# Altium schematic sheet HV_Piezo_Driver.SchDoc
size 419 x 297 mm; SheetNumber: 3; SheetTotal: 4
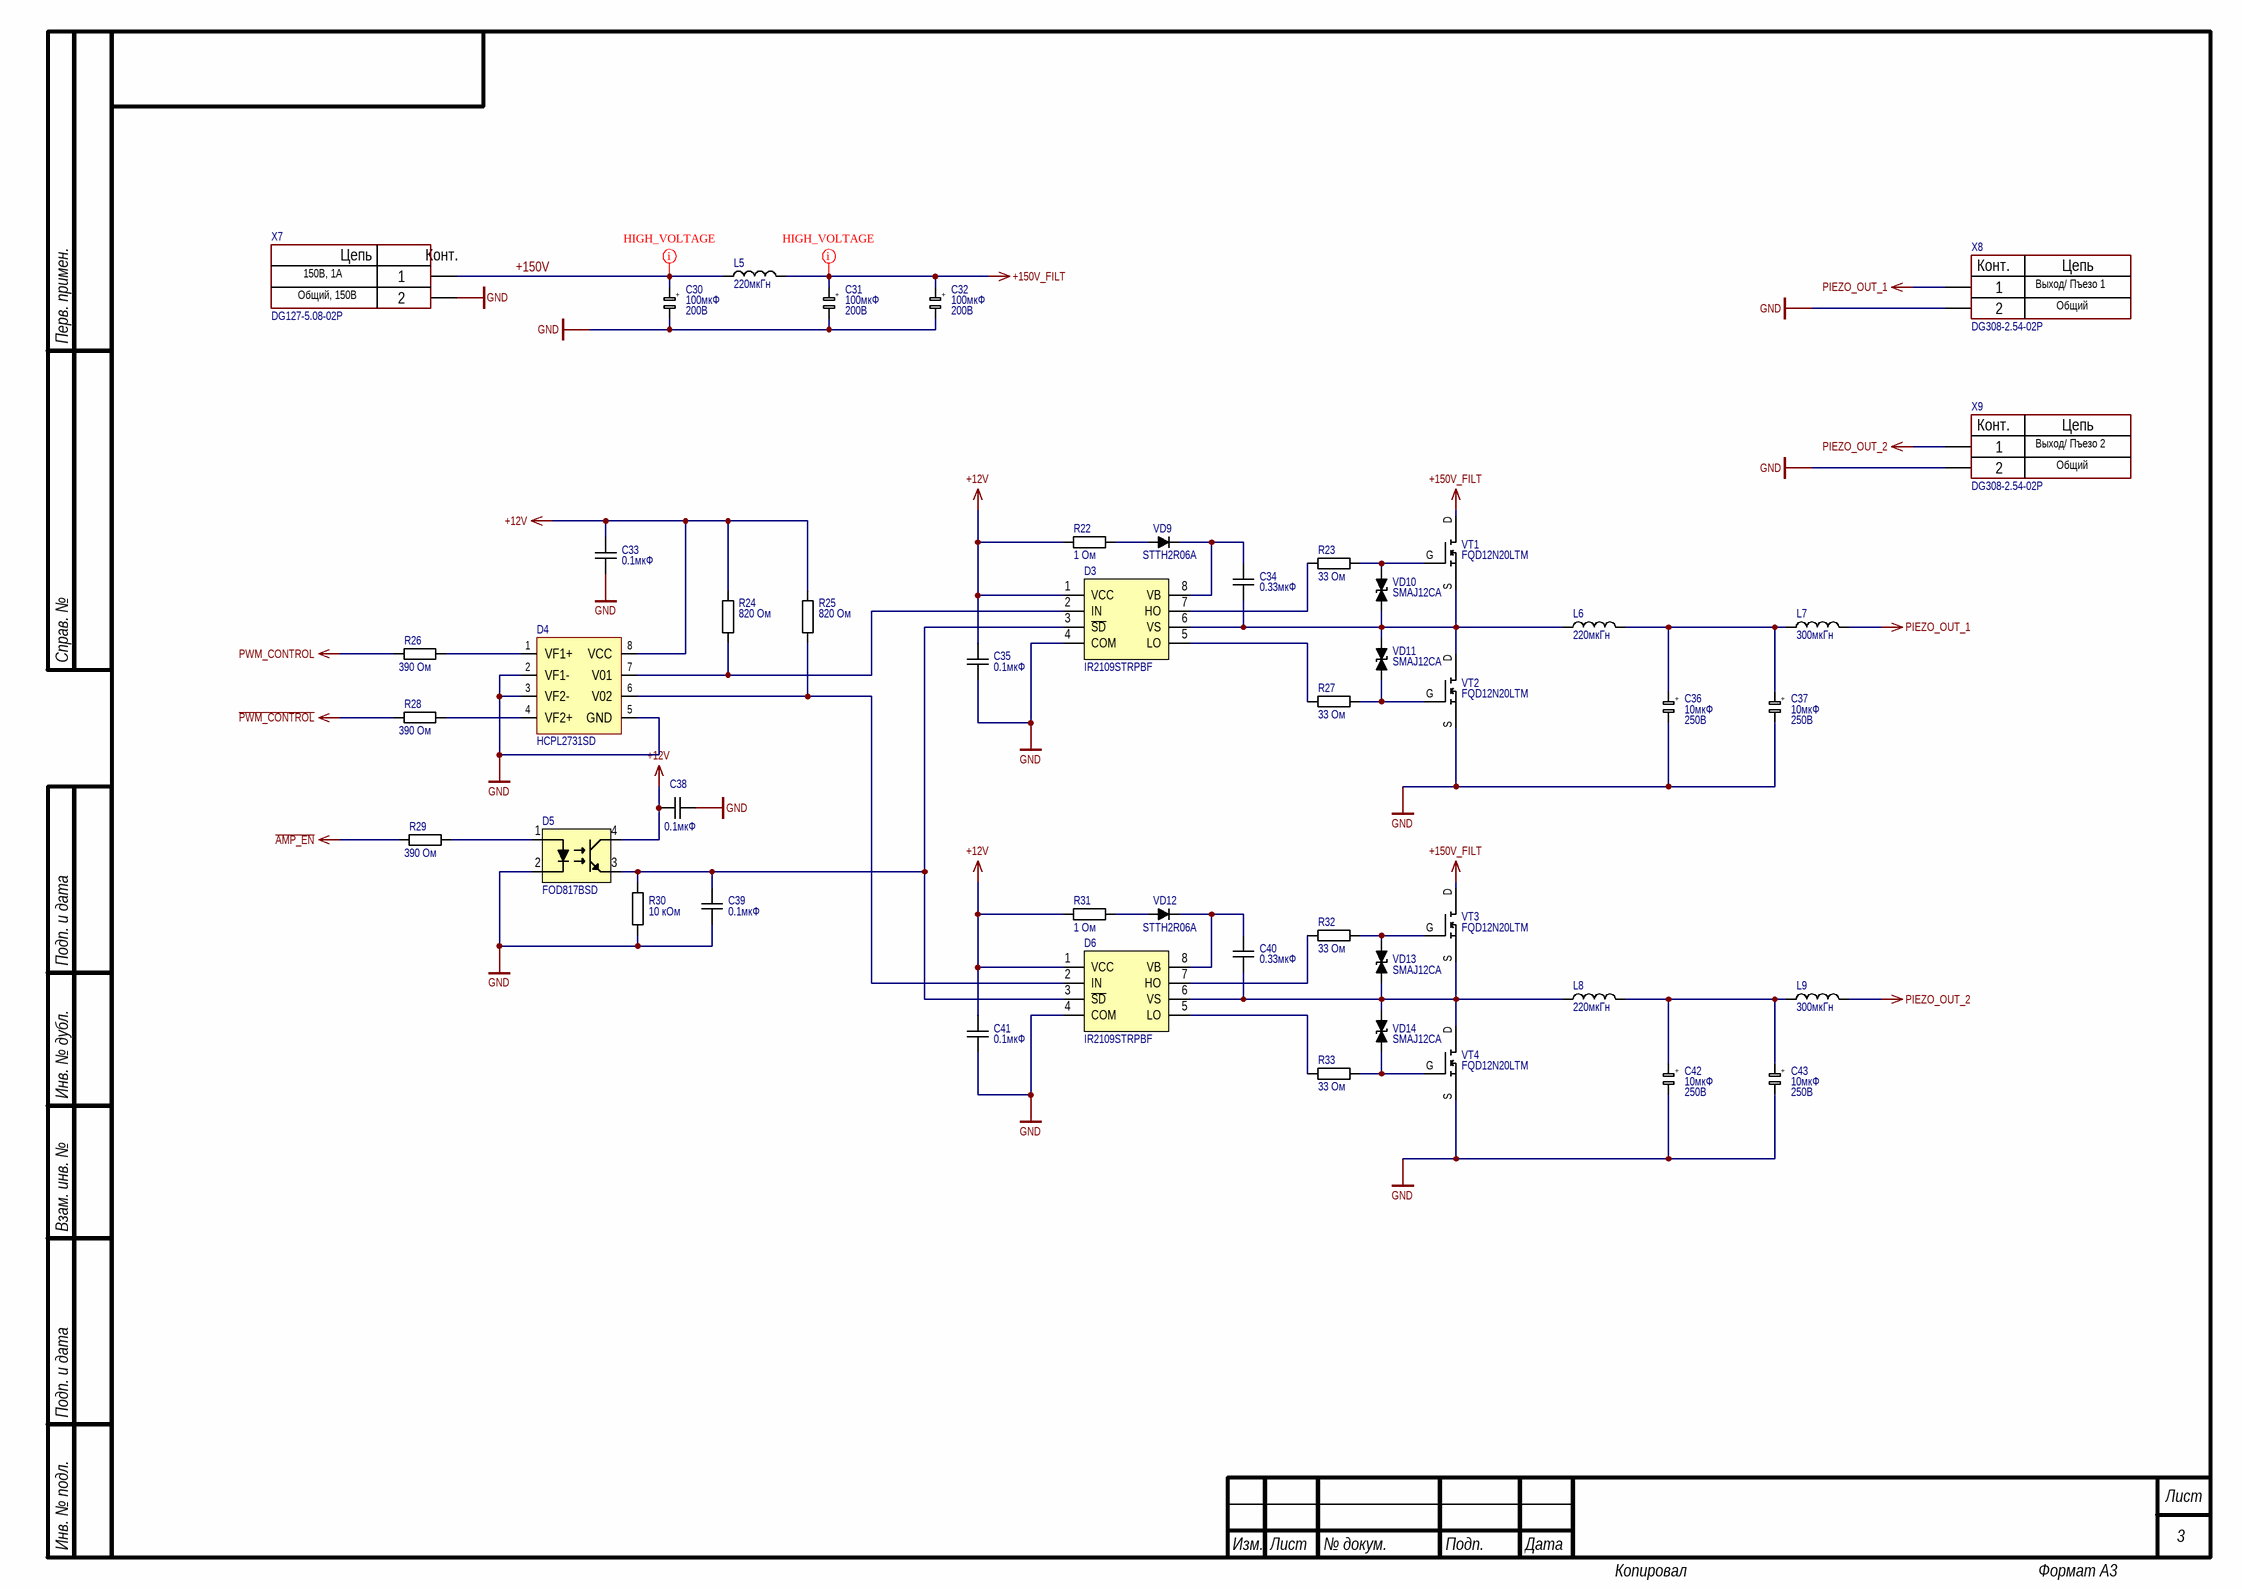
[diagram p0: HV_Piezo_Driver.SchDoc]

## Parts
C30  value 100мкФ  Voltage: 200В  [CAP_RADIAL_13x17_P5]  (hidden comment: CAP-100мкФ-20%-200В-105°C-Radial)
C31  value 100мкФ  Voltage: 200В  [CAP_RADIAL_13x17_P5]  (hidden comment: CAP-100мкФ-20%-200В-105°C-Radial)
C32  value 100мкФ  Voltage: 200В  [CAP_RADIAL_13x17_P5]  (hidden comment: CAP-100мкФ-20%-200В-105°C-Radial)
C33  value 0.1мкФ  [CAP-0603]  (hidden comment: CAP-0.1мкФ-10%-50В-X7R-0603)
C34  value 0.33мкФ  [CAP-0805]  (hidden comment: CAP-0.33мкФ-10%-25В-X7R-0805)
C35  value 0.1мкФ  [CAP-0603]  (hidden comment: CAP-0.1мкФ-10%-50В-X7R-0603)
C36  value 10мкФ  Voltage: 250В  [CAP_RADIAL_10x20_P5]  (hidden comment: CAP-10мкФ-20%-250В-105°C-Radial)
C37  value 10мкФ  Voltage: 250В  [CAP_RADIAL_10x20_P5]  (hidden comment: CAP-10мкФ-20%-250В-105°C-Radial)
C38  value 0.1мкФ  [CAP-0603]  (hidden comment: CAP-0.1мкФ-10%-50В-X7R-0603)
C39  value 0.1мкФ  [CAP-0603]  (hidden comment: CAP-0.1мкФ-10%-50В-X7R-0603)
C40  value 0.33мкФ  [CAP-0805]  (hidden comment: CAP-0.33мкФ-10%-25В-X7R-0805)
C41  value 0.1мкФ  [CAP-0603]  (hidden comment: CAP-0.1мкФ-10%-50В-X7R-0603)
C42  value 10мкФ  Voltage: 250В  [CAP_RADIAL_10x20_P5]  (hidden comment: CAP-10мкФ-20%-250В-105°C-Radial)
C43  value 10мкФ  Voltage: 250В  [CAP_RADIAL_10x20_P5]  (hidden comment: CAP-10мкФ-20%-250В-105°C-Radial)
D3  IR2109STRPBF  [SOIC-8]
D4  HCPL2731SD  [SMD-8]
D5  FOD817BSD  [SMD-4]
D6  IR2109STRPBF  [SOIC-8]
L5  Inductance: 220мкГн  [IND_12.3X12.3]  (hidden comment: SPRH127-221M)
L6  Inductance: 220мкГн  [IND_12.3X12.3]  (hidden comment: SPRH127-221M)
L7  Inductance: 300мкГн  [IND_7.8X7.8]  (hidden comment: SDR0805-331KL)
L8  Inductance: 220мкГн  [IND_12.3X12.3]  (hidden comment: SPRH127-221M)
L9  Inductance: 300мкГн  [IND_7.8X7.8]  (hidden comment: SDR0805-331KL)
R22  value 1 Ом  [RES-1206]  (hidden comment: RES-1 Ом-5%-0.25Вт-1206)
R23  value 33 Ом  [RES-1206]  (hidden comment: RES-33 Ом-5%-0,25Вт-1206)
R24  value 820 Ом  [RES-1206]  (hidden comment: RES-820 Ом-5%-0.25Вт-1206)
R25  value 820 Ом  [RES-1206]  (hidden comment: RES-820 Ом-5%-0.25Вт-1206)
R26  value 390 Ом  [RES-0603]  (hidden comment: RES-390 Ом-5%-250мВт-0603)
R27  value 33 Ом  [RES-1206]  (hidden comment: RES-33 Ом-5%-0,25Вт-1206)
R28  value 390 Ом  [RES-0603]  (hidden comment: RES-390 Ом-5%-250мВт-0603)
R29  value 390 Ом  [RES-0603]  (hidden comment: RES-390 Ом-5%-250мВт-0603)
R30  value 10 кОм  [RES-0603]  (hidden comment: RES-10 кОм-5%-0.1Вт-0603)
R31  value 1 Ом  [RES-1206]  (hidden comment: RES-1 Ом-5%-0.25Вт-1206)
R32  value 33 Ом  [RES-1206]  (hidden comment: RES-33 Ом-5%-0,25Вт-1206)
R33  value 33 Ом  [RES-1206]  (hidden comment: RES-33 Ом-5%-0,25Вт-1206)
VD9  STTH2R06A  [SMA]
VD10  SMAJ12CA  [DO-214AC]
VD11  SMAJ12CA  [DO-214AC]
VD12  STTH2R06A  [SMA]
VD13  SMAJ12CA  [DO-214AC]
VD14  SMAJ12CA  [DO-214AC]
VT1  FQD12N20LTM  [DPAK3]
VT2  FQD12N20LTM  [DPAK3]
VT3  FQD12N20LTM  [DPAK3]
VT4  FQD12N20LTM  [DPAK3]
X7  DG127-5.08-02P  Curciut 2: Общий, 150В  Curciut 1: 150В, 1А  [DG12750802P141000AH]
X8  DG308-2.54-02P  Curciut 2: Общий  Curciut 1: Выход/ Пъезо 1  [DG30825402P1400AH]
X9  DG308-2.54-02P  Curciut 2: Общий  Curciut 1: Выход/ Пъезо 2  [DG30825402P1400AH]

## Nets
+12V: C33.2 C35.2 C38.2 C41.2 D3.1(VCC) D4.8(VCC) D5.4(COLLECTOR) D6.1(VCC) R22.1 R24.2 R25.2 R31.1
+150V_FILT: C31.P C32.P L5.2 VT1.D VT3.D
~{AMP_EN}: R29.1
GND: C30.N C31.N C32.N C33.1 C35.1 C36.N C37.N C38.1 C39.1 C41.1 C42.N C43.N D3.4(COM) D4.2(VF1-) D4.3(VF2-) D4.5(GND) D5.2(CATHODE) D6.4(COM) R30.1 VT2.S VT4.S X7.2 X8.2 X9.2
~{PWM_CONTROL}: R28.1
PIEZO_OUT_1: L7.2 X8.1
PIEZO_OUT_2: L9.2 X9.1
PWM_CONTROL: R26.1
+150V: C30.P L5.1 X7.1
NetC34_1: C34.1 D3.6(VS) L6.1 VD10.C VD11.A VT1.S VT2.D
NetC34_2: C34.2 D3.8(VB) VD9.2(A)
NetC36_P: C36.P C37.P L6.2 L7.1
NetC39_2: C39.2 D3.3(~{SD}) D5.3(EMITTER) D6.3(~{SD}) R30.2
NetC40_1: C40.1 D6.6(VS) L8.1 VD13.C VD14.A VT3.S VT4.D
NetC40_2: C40.2 D6.8(VB) VD12.2(A)
NetC42_P: C42.P C43.P L8.2 L9.1
NetD3_2: D3.2(IN) D4.7(V01) R24.1
NetD3_5: D3.5(LO) R27.1
NetD3_7: D3.7(HO) R23.1
NetD4_1: D4.1(VF1+) R26.2
NetD4_4: D4.4(VF2+) R28.2
NetD4_6: D4.6(V02) D6.2(IN) R25.1
NetD5_1: D5.1(ANODE) R29.2
NetD6_5: D6.5(LO) R33.1
NetD6_7: D6.7(HO) R32.1
NetR22_2: R22.2 VD9.1(K)
NetR23_2: R23.2 VD10.A VT1.G
NetR27_2: R27.2 VD11.C VT2.G
NetR31_2: R31.2 VD12.1(K)
NetR32_2: R32.2 VD13.A VT3.G
NetR33_2: R33.2 VD14.C VT4.G

## Layout directives
net class HIGH_VOLTAGE: +150V, +150V_FILT

## Notes on the sheet
- Перв. примен.
- Справ. №
- Подп. и дата
- Инв. № дубл.
- Взам. инв. №
- Изм.
- Лист
- № докум.
- Подп.
- Дата
- Инв. № подл.
- Копировал
- Формат А3
- (in symbol DG127-5.08-02P) Цепь; Конт.
- (in symbol DG308-2.54-02P) Конт.; Цепь
- (in symbol JRB2D101M05001300250000B) +
- (in symbol JRB2E100M05001000170000B) +

## Library data of the parts
C30-C32 = JRB2D101M05001300250000B: 100мкФ, 200В, 105°C, 20%, 13x25мм P:5мм, JRB2D101M05001300250000B (К50-35 имп.), Конденсатор электролитический алюминиевый; Supplier 1: https://www.chipdip.ru/product/100mkf-200v-105-c-20-13x25mm-p-5mm-jb-capacitors-9000565896; Tolerance: 20%; Manufacturer Part Number: JRB2D101M05001300250000B; Temperature: 105°C
C33 C35 C38 C39 C41 = Cap_0603: Конденсатор; Manufacturer Part Number: GRM188R71H104K; Tolerance: 10%; Voltage: 50В; Temperature: X7R; Supplier 1: https://www.chipdip.ru/product/0.1mkf-x7r-50v-10-0603-grm188r71h104k-kondensator-murata-32715842
C34 C40 = Cap_0805: Конденсатор; Manufacturer Part Number: GRM21BR71E334K; Tolerance: 10%; Voltage: 25В; Temperature: X7R; Supplier 1: https://www.chipdip.ru/product/0.33mkf-x7r-25v-10-0805-grm21br71e334k-kondensator-murata-263924069
C36 C37 C42 C43 = JRB2E100M05001000170000B: 10мкФ, 250В, 105°C, 20%, 10x17мм P:5мм, JRB2E100M05001000170000B (К50-35 имп.), Конденсатор электролитический алюминиевый; Supplier 1: https://www.chipdip.ru/product/10mkf-250v-105-c-20-10x17mm-p-5mm-jb-capacitors-9000565843; Tolerance: 20%; Manufacturer Part Number: JRB2E100M05001000170000B; Temperature: 105°C
D3 D6 = IR2109STRPBF: Драйвер полумостовой; Operating Supply Current: 1.6 mA; Output Current: 120 mA; Output Voltage -Min: 10 V; Output Voltage - Max: 20 V; Power: 625mW; Supplier 1: https://www.chipdip.ru/product/ir2109strpbf-infineon-8012901923; Supply Voltage -Min: 10 V; Supply Voltage -Max: 20 V; Operating temperature: -40…125°C
D4 = HCPL2731SD: Оптоизолятор 2.5кВ двухканальный с транзистором Дарлингтона 8SMD; Output Current: 60 mA; Vf - Forward Voltage: 1.3 V; Vr - Reverse Voltage: 5 V; If - Forward Current: 1.6 mA; Supplier 1: https://www.chipdip.ru/product/hcpl2731sd-on-semiconductor-8031911084; Maximum Operating Temperature: 100 C; Minimum Operating Temperature: -40 C
D5 = FOD817BSD: Optocoupler, Transistor Output, 1 Channel, Surface Mount DIP, 4 Pins, 50 mA, 5 kV, 130 %; Manufacturer: onsemi; Manufacturer Lifecycle Status: ACTIVE; Collector Emitter Breakdown Voltage: 70V; Collector Emitter Saturation Voltage: 200mV; Current Transfer Ratio: 130%; Dark Current: 100nA; Fall Time: 18µs; Forward Current: 50mA; Forward Voltage: 1.4V; Isolation Voltage: 5kV; Max Junction Temperature (Tj): 125°C; Max Power Dissipation: 150mW; Number of Channels: 1; Power Dissipation: 200mW; Reverse Breakdown Voltage: 6V; Supplier: Future Electronics; Supplier Part Number: 1190577; Manufacturer Part Number: FOD817BSD; RoHS: Compliant; Category: Optocouplers; Stock: 578000; Pricing: 1000=0,0878, 3000=0,0853, 4000=0,0847, 10000=0,0827, 15000=0,0807 (USD); Case/Package: SMD/SMT; China RoHS: Compliant; Collector Emitter Voltage (VCEO): 70V; Contact Plating: Tin; Country of Origin: Thailand; Export Control Classification Number (ECCN) Code: EAR99; Height: 4.35mm; Harmonized Tariff Schedule (HTS) Code: 8541.40.80.00; Input Current: 50mA; Introduction Date: 2004-04-28; Lead Free: Lead Free; Length: 5.1mm; Lifecycle Status: Production; Max Collector Current: 50mA; Max Input Current: 50mA; Max Operating Temperature: 110°C; Max Output Voltage: 70V; Min Operating Temperature: -55°C; Mounting Technology: Surface Mount; Number of Circuits: 1; Number of Elements: 1; Pins: 4; Output Current per Channel: 50mA; Output Voltage: 70V; Radiation Hardening: No; REACH SVHC: Yes; Reverse Voltage: 6V; Reverse Voltage (DC): 6V; Rise Time: 18µs; Schedule B: 8541408000, 8541408000|8541408000, 8541408000|8541408000|8541408000, 8541408000|8541408000|8541408000|8541408000; Weight: 0g; Width: 7mm; ComponentLink1URL: https://datasheet.octopart.com:443/FOD817BSD-onsemi-datasheet-180960478.pdf?src-supplier=IHS; ComponentLink1Description: https://datasheet.octopart.com:443/FOD817BSD-onsemi-datasheet-180960478.pdf?src-supplier=IHS; ComponentLink2URL: https://datasheet.octopart.com:443/FOD817BSD-Fairchild-Semiconductor-datasheet-67010145.pdf?src-supplier=IHS; ComponentLink2Description: https://datasheet.octopart.com:443/FOD817BSD-Fairchild-Semiconductor-datasheet-67010145.pdf?src-supplier=IHS; ComponentLink3URL: https://datasheet.octopart.com:443/FOD817BSD-ON-Semiconductor-datasheet-113093828.pdf?src-supplier=JRH+Electronics; ComponentLink3Description: https://datasheet.octopart.com:443/FOD817BSD-ON-Semiconductor-datasheet-113093828.pdf?src-supplier=JRH+Electronics; ComponentLink4URL: https://sigma.octopart.com:443/138799925/technical_drawing/ON-Semiconductor-FOD817BSD.pdf?src-supplier=Upverter; ComponentLink4Description: https://sigma.octopart.com:443/138799925/technical_drawing/ON-Semiconductor-FOD817BSD.pdf?src-supplier=Upverter; ComponentLink5URL: https://datasheet.octopart.com:443/FOD817BSD-ON-Semiconductor-datasheet-11629806.pdf?src-supplier=TME; ComponentLink5Description: https://datasheet.octopart.com:443/FOD817BSD-ON-Semiconductor-datasheet-11629806.pdf?src-supplier=TME; ComponentLink6URL: https://datasheet.octopart.com:443/FOD817BSD-onsemi-datasheet-188912653.pdf?src-supplier=TME; ComponentLink6Description: https://datasheet.octopart.com:443/FOD817BSD-onsemi-datasheet-188912653.pdf?src-supplier=TME; ComponentLink7URL: https://datasheet.octopart.com:443/FOD817BSD-ON-Semiconductor-datasheet-99207756.pdf?src-supplier=Future+Electronics; ComponentLink7Description: https://datasheet.octopart.com:443/FOD817BSD-ON-Semiconductor-datasheet-99207756.pdf?src-supplier=Future+Electronics; ComponentLink8URL: https://datasheet.octopart.com:443/FOD817BSD-Fairchild-Semiconductor-datasheet-8324556.pdf?src-supplier=Future+Electronics; ComponentLink8Description: https://datasheet.octopart.com:443/FOD817BSD-Fairchild-Semiconductor-datasheet-8324556.pdf?src-supplier=Future+Electronics; ComponentLink9URL: https://datasheet.octopart.com:443/FOD817BSD-ON-Semiconductor-datasheet-98551328.pdf?src-supplier=onsemi; ComponentLink9Description: https://datasheet.octopart.com:443/FOD817BSD-ON-Semiconductor-datasheet-98551328.pdf?src-supplier=onsemi; ComponentLink10URL: https://datasheet.octopart.com:443/FOD817BSD-ON-Semiconductor-datasheet-85522120.pdf?src-supplier=onsemi; ComponentLink10Description: https://datasheet.octopart.com:443/FOD817BSD-ON-Semiconductor-datasheet-85522120.pdf?src-supplier=onsemi; ComponentLink11URL: https://datasheet.octopart.com:443/FOD817BSD-ON-Semiconductor-datasheet-86695365.pdf?src-supplier=onsemi; ComponentLink11Description: https://datasheet.octopart.com:443/FOD817BSD-ON-Semiconductor-datasheet-86695365.pdf?src-supplier=onsemi; ComponentLink12URL: https://datasheet.octopart.com:443/FOD817BSD-ON-Semiconductor-datasheet-86689748.pdf?src-supplier=element14+APAC; ComponentLink12Description: https://datasheet.octopart.com:443/FOD817BSD-ON-Semiconductor-datasheet-86689748.pdf?src-supplier=element14+APAC; ComponentLink13URL: https://datasheet.octopart.com:443/FOD817BSD-Fairchild-datasheet-2482.pdf?src-supplier=Mouser; ComponentLink13Description: https://datasheet.octopart.com:443/FOD817BSD-Fairchild-datasheet-2482.pdf?src-supplier=Mouser; ComponentLink14URL: https://datasheet.octopart.com:443/FOD817BSD-Fairchild-Semiconductor-datasheet-49579151.pdf?src-supplier=Newark; ComponentLink14Description: https://datasheet.octopart.com:443/FOD817BSD-Fairchild-Semiconductor-datasheet-49579151.pdf?src-supplier=Newark; ComponentLink15URL: https://datasheet.octopart.com:443/FOD817BSD-ON-Semiconductor-datasheet-91365929.pdf?src-supplier=Newark; ComponentLink15Description: https://datasheet.octopart.com:443/FOD817BSD-ON-Semiconductor-datasheet-91365929.pdf?src-supplier=Newark; ComponentLink16URL: https://datasheet.octopart.com:443/FOD817BSD-onsemi-datasheet-189128609.pdf?src-supplier=Master+Electronics; ComponentLink16Description: https://datasheet.octopart.com:443/FOD817BSD-onsemi-datasheet-189128609.pdf?src-supplier=Master+Electronics; ComponentLink17URL: https://sigma.octopart.com:443/33167772/technical_drawing/Fairchild-Semiconductor-FOD817BSD.pdf?src-supplier=Fairchild+Semiconductor; ComponentLink17Description: https://sigma.octopart.com:443/33167772/technical_drawing/Fairchild-Semiconductor-FOD817BSD.pdf?src-supplier=Fairchild+Semiconductor; ComponentLink18URL: https://sigma.octopart.com:443/17350082/technical_drawing/Fairchild-Semiconductor-FOD817BSD.pdf?src-supplier=Fairchild+Semiconductor; ComponentLink18Description: https://sigma.octopart.com:443/17350082/technical_drawing/Fairchild-Semiconductor-FOD817BSD.pdf?src-supplier=Fairchild+Semiconductor; ComponentLink19URL: https://datasheet.octopart.com:443/FOD817BSD-Fairchild-datasheet-8637997.pdf?src-supplier=Jameco; ComponentLink19Description: https://datasheet.octopart.com:443/FOD817BSD-Fairchild-datasheet-8637997.pdf?src-supplier=Jameco; ComponentLink20URL: https://datasheet.octopart.com:443/FOD817BSD-Fairchild-Semiconductor-datasheet-61452342.pdf?src-supplier=Farnell; ComponentLink20Description: https://datasheet.octopart.com:443/FOD817BSD-Fairchild-Semiconductor-datasheet-61452342.pdf?src-supplier=Farnell; ComponentLink21URL: https://datasheet.octopart.com:443/FOD817BSD-Fairchild-Semiconductor-datasheet-62114928.pdf?src-supplier=Farnell; ComponentLink21Description: https://datasheet.octopart.com:443/FOD817BSD-Fairchild-Semiconductor-datasheet-62114928.pdf?src-supplier=Farnell; ComponentLink22URL: http://sigma.octopart.com:80/150610482/rohs_statement/ON-Semiconductor-FOD817BSD.pdf?src-supplier=Compliance+Statements; ComponentLink22Description: http://sigma.octopart.com:80/150610482/rohs_statement/ON-Semiconductor-FOD817BSD.pdf?src-supplier=Compliance+Statements; ComponentLink23URL: http://sigma.octopart.com:80/17350094/reach_statement/Fairchild-Semiconductor-FOD817BSD.pdf?src-supplier=Compliance+Statements; ComponentLink23Description: http://sigma.octopart.com:80/17350094/reach_statement/Fairchild-Semiconductor-FOD817BSD.pdf?src-supplier=Compliance+Statements; ComponentLink24URL: http://sigma.octopart.com:80/17350098/materials_sheet/Fairchild-Semiconductor-FOD817BSD.pdf?src-supplier=Compliance+Statements; ComponentLink24Description: http://sigma.octopart.com:80/17350098/materials_sheet/Fairchild-Semiconductor-FOD817BSD.pdf?src-supplier=Compliance+Statements; ComponentLink25URL: http://sigma.octopart.com:80/33167956/reach_statement/Fairchild-Semiconductor-FOD817BSD.pdf?src-supplier=Compliance+Statements; ComponentLink25Description: http://sigma.octopart.com:80/33167956/reach_statement/Fairchild-Semiconductor-FOD817BSD.pdf?src-supplier=Compliance+Statements; ComponentLink26URL: http://sigma.octopart.com:80/33167957/materials_sheet/Fairchild-Semiconductor-FOD817BSD.pdf?src-supplier=Compliance+Statements; ComponentLink26Description: http://sigma.octopart.com:80/33167957/materials_sheet/Fairchild-Semiconductor-FOD817BSD.pdf?src-supplier=Compliance+Statements; ComponentLink27URL: http://sigma.octopart.com:80/reach_statement/ON-Semiconductor-company-79.pdf?src-supplier=Compliance+Statements; ComponentLink27Description: http://sigma.octopart.com:80/reach_statement/ON-Semiconductor-company-79.pdf?src-supplier=Compliance+Statements; ComponentLink28URL: http://sigma.octopart.com:80/rohs_statement/Fairchild-Semiconductor-company-11.pdf?src-supplier=Compliance+Statements; ComponentLink28Description: http://sigma.octopart.com:80/rohs_statement/Fairchild-Semiconductor-company-11.pdf?src-supplier=Compliance+Statements; ComponentLink29URL: http://sigma.octopart.com:80/rohs_statement/Fairchild-Semiconductor-company-10.pdf?src-supplier=Compliance+Statements; ComponentLink29Description: http://sigma.octopart.com:80/rohs_statement/Fairchild-Semiconductor-company-10.pdf?src-supplier=Compliance+Statements; ComponentLink30URL: http://sigma.octopart.com:80/reach_statement/Fairchild-Semiconductor-company-9.pdf?src-supplier=Compliance+Statements; ComponentLink30Description: http://sigma.octopart.com:80/reach_statement/Fairchild-Semiconductor-company-9.pdf?src-supplier=Compliance+Statements; ComponentLink31URL: https://octopart.com:443/opatz8j6/c1?t=2OuS15dud8hiB_awp-DQ-07s1LQDF22Cr1fwQKtyVtUYb04vdBjUyNDKKuvr4wkdRxLtERHgqViJqWkTeNBKTdnTkVY2D1nDxfbO5h2fF1LfkcGDWl4D222U1D-tBlXhHTxouI2AVsrzVRemG0SS3H6sW1MSOkrKkFJ4G0RoiKxMnzMg8mILW7BVIW19nuoux7fwrO0RunnQ-qEWRZB9nm4RjI5EnRBraXhhg_8Jbf0Z5zDmWE4pmUtAopGBxl1lqpyawLRVoWByB2PNMH9fKF0UjTc-KtwwjIOepqcHmBTwo6_YdKVeaWahmHfZtg9hUP14M4pE3RtfggEzRX9LWEFlvFULr5TZ0fLS&src-supplier=Compliance+Statements; ComponentLink31Description: https://octopart.com:443/opatz8j6/c1?t=2OuS15dud8hiB_awp-DQ-07s1LQDF22Cr1fwQKtyVtUYb04vdBjUyNDKKuvr4wkdRxLtERHgqViJqWkTeNBKTdnTkVY2D1nDxfbO5h2fF1LfkcGDWl4D222U1D-tBlXhHTxouI2AVsrzVRemG0SS3H6sW1MSOkrKkFJ4G0RoiKxMnzMg8mILW7BVIW19nuoux7fwrO0RunnQ-qEWRZB9nm4RjI5EnRBraXhhg_8Jbf0Z5zDmWE4pmUtAopGBxl1lqpyawLRVoWByB2PNMH9fKF0UjTc-KtwwjIOepqcHmBTwo6_YdKVeaWahmHfZtg9hUP14M4pE3RtfggEzRX9LWEFlvFULr5TZ0fLS&src-supplier=Compliance+Statements; ComponentLink32URL: https://octopart.com:443/opatz8j6/c1?t=FFG_DC80JtruglX_HDP91gzsMwR13fxxkH_F3qcsgv835Sckaqh0XoMMkjr9Xm6n53vUMcFhZdRxZUaOiXKEpziVr_MHF241f_irKM6sV7CDFCSg9OIr6yiMkTD2zr6wiIa6WV_NkigJy29Fhwmg1m-UuSG1FnEbeldEUFG0L2j6ZHDzDhgkJHKMYl647Yu2VnJhiyvnXuXJW9BQy0wQcz7wOqUYovLIYLqOxKZMCY31ibnz1zvaL2IfdgsKEKbqjrdm2M9R683KWiwGreD87g6pEsuBtui6WuaAQ53GxNzJ4q_5BlDemMzchI0axU44Y1EiajOyTCBavRYBXk7g4Zi4MYonob1uQF220w&src-supplier=Compliance+Statements; ComponentLink32Description: https://octopart.com:443/opatz8j6/c1?t=FFG_DC80JtruglX_HDP91gzsMwR13fxxkH_F3qcsgv835Sckaqh0XoMMkjr9Xm6n53vUMcFhZdRxZUaOiXKEpziVr_MHF241f_irKM6sV7CDFCSg9OIr6yiMkTD2zr6wiIa6WV_NkigJy29Fhwmg1m-UuSG1FnEbeldEUFG0L2j6ZHDzDhgkJHKMYl647Yu2VnJhiyvnXuXJW9BQy0wQcz7wOqUYovLIYLqOxKZMCY31ibnz1zvaL2IfdgsKEKbqjrdm2M9R683KWiwGreD87g6pEsuBtui6WuaAQ53GxNzJ4q_5BlDemMzchI0axU44Y1EiajOyTCBavRYBXk7g4Zi4MYonob1uQF220w&src-supplier=Compliance+Statements; Supplier 1: https://www.chipdip.ru/product/fod817bsd-optoizolyator-5kv-optopara-on-semiconductor-9000101821
L5 L6 L8 = SPRH127-221M: 220мкГн, 2.22А, 12.3х12.3х8 мм, Катушка индуктивности SMD; Current - Saturation (Isat): 2.22A; Current Rating (Amps): 1.63A; Supplier 1: https://www.chipdip.ru/product/cdsprh127-221m-220mkgn-2.22a-12.3x12.3x8-mm-katushka-sce-9001493335
L7 L9 = SDR0805-331KL: 330мкГн, 0.4А, Индуктивность SMD; Current - Saturation (Isat): 580 mA; Current Rating (Amps): 400 mA; Supplier 1: https://www.chipdip.ru/product/sdr0805-331kl-330mkgn-0.4a-induktivnost-smd-bourns-9000090969
R22 R31 = Res_1206: Резистор; Manufacturer Part Number: RC1206JR-071RL; Tolerance: 5%; Power: 0.25Вт; Supplier 1: https://www.chipdip.ru/product/0.25vt-1206-1-om-5-rc1206jr-071rl-chip-rezistor-smd-yageo-9000226200
R23 R27 R32 R33 = Res_1206: Резистор; Manufacturer Part Number: RC1206JR-0733RL; Tolerance: 5%; Power: 0,25Вт; Supplier 1: https://www.chipdip.ru/product/0.25vt-1206-33-om-5-rc1206jr-0733rl-chip-rezistor-smd-yageo-9000247852
R24 R25 = Res_1206: Резистор; Manufacturer Part Number: RC1206JR-07820RL; Tolerance: 5%; Power: 0.25Вт; Supplier 1: https://www.chipdip.ru/product/0.25vt-1206-820-om-5-rc1206jr-07820rl-chip-rezistor-yageo-9000956179
R26 R28 R29 = Res_0603: Резистор; Manufacturer Part Number: AS03W4J0391T5E; Power: 250мВт; Tolerance: 5%; Supplier 1: https://www.chipdip.ru/product/as03w4j0391t5e-tolstoplenochnyy-rezistor-250mvt-uni-royal-8016244225
R30 = Res_0603: Резистор; Manufacturer Part Number: RC0603JR-0710KL; Power: 0.1Вт; Tolerance: 5%; Supplier 1: https://www.chipdip.ru/product/0.1vt-0603-10-kom-5-rc0603jr-0710kl-chip-rezistor-smd-yageo-9000103456
VD9 VD12 = STTH2R06A: Rectifier Diode, 1 Phase, 1 Element, 2A, 600V V(RRM), Silicon; Manufacturer: STMicroelectronics; Element Configuration: Single; Forward Voltage: 1.25V; Max Forward Surge Current (Ifsm): 30A; Max Junction Temperature (Tj): 175°C; Number of Elements: 1; Peak Reverse Current: 2µA; Polarity: Standard; Recovery Time: 50ns; Supplier: RS; Supplier Part Number: 1685754; Manufacturer Part Number: STTH2R06A; RoHS: Compliant; Category: Rectifier Diodes; Stock: 4220; Pricing: 5000=0,1 (GBP); Average Rectified Current: 2A; Case/Package: SMA; China RoHS: Non-Compliant; Contact Plating: Tin; Country of Origin: Mainland China; Current Rating: 2A; Export Control Classification Number (ECCN) Code: EAR99; Forward Current: 2A; Height: 2.03mm; Harmonized Tariff Schedule (HTS) Code: 8541.10.00.80; Introduction Date: 2004-09-07; Lead Free: Lead Free; Length: 4.6mm; Lifecycle Status: Production; Max Operating Temperature: 175°C; Max Output current: 2A; Max Repetitive Reverse Voltage (Vrrm): 600V; Max Reverse Voltage (DC): 600V; Max Surge Current: 30A; Min Operating Temperature: -40°C; Mounting Technology: Surface Mount; Pins: 2; Number of Terminals: 2; Output Current: 2A; Packaging: Tape and Reel; Peak Non-Repetitive Surge Current: 30A; Radiation Hardening: No; REACH SVHC: No; Reverse Recovery Time: 50ns; Reverse Standoff Voltage: 600V; Reverse Voltage: 600V; Schedule B: 8541100080, 8541100080|8541100080|8541100080|8541100080|8541100080; Voltage Rating (DC): 600V; Width: 2.95mm; ComponentLink1URL: https://datasheet.octopart.com:443/STTH2R06A-STMicroelectronics-datasheet-8449154.pdf?src-supplier=element14+APAC; ComponentLink1Description: https://datasheet.octopart.com:443/STTH2R06A-STMicroelectronics-datasheet-8449154.pdf?src-supplier=element14+APAC; ComponentLink2URL: https://datasheet.octopart.com:443/STTH2R06A-STMicroelectronics-datasheet-12526389.pdf?src-supplier=Newark; ComponentLink2Description: https://datasheet.octopart.com:443/STTH2R06A-STMicroelectronics-datasheet-12526389.pdf?src-supplier=Newark; ComponentLink3URL: https://datasheet.octopart.com:443/STTH2R06A-STMicroelectronics-datasheet-14054141.pdf?src-supplier=iiiC; ComponentLink3Description: https://datasheet.octopart.com:443/STTH2R06A-STMicroelectronics-datasheet-14054141.pdf?src-supplier=iiiC; ComponentLink4URL: https://datasheet.octopart.com:443/STTH2R06A-STMicroelectronics-datasheet-8633837.pdf?src-supplier=Jameco; ComponentLink4Description: https://datasheet.octopart.com:443/STTH2R06A-STMicroelectronics-datasheet-8633837.pdf?src-supplier=Jameco; ComponentLink5URL: https://datasheet.octopart.com:443/STTH2R06A-STMicroelectronics-datasheet-30637.pdf?src-supplier=DigiKey; ComponentLink5Description: https://datasheet.octopart.com:443/STTH2R06A-STMicroelectronics-datasheet-30637.pdf?src-supplier=DigiKey; Supplier 1: https://www.chipdip.ru/product/stth2r02a-st-microelectronics-8000276925
VD10 VD11 VD13 VD14 = SMAJ12CA: Диод защитный от перенапряжения - TVS (супрессор) 12В включение 19.9В ограничение SMA; Maximum Clamping Voltage (V): 25.3 V; Maximum Peak Pulse Current (A): 91 A; Minimum Breakdown Voltage (V): 13.3 V; Breakdown Voltage: 14 V; Supplier 1: https://www.chipdip.ru/product/smaj12ca-tr-st-microelectronics-8124212433
VT1-VT4 = FQD12N20LTM: Fairchild Semiconductor’s new QFET® planar MOSFETs use advanced, proprietary technology to offer best-in-class operating performance for a wide range of applications, including power supplies, PFC (Power Factor Correction), DC-DC Converters, Plasma Display Panels (PDP), lighting ballasts, and motion control.; Continuous Drain Current Id: 9A; Rds(on) Test Voltage: 10V; Power Dissipation: 2.5W; Drain Source On State Resistance: 0.28ohm; Channel Type: N Channel; Gate Source Threshold Voltage Max: 2V; Drain Source Voltage Vds: 200V; Supplier 1: https://www.chipdip.ru/product/fqd12n20ltm-tranzistor-n-mosfet-200v-9a-on-semiconductor-9050001558
X7 = DG127-5.08-02P: Terminal block DG127-5.08-02P-14-00AH, 2-ways, vertical, 5.08mm, screw (-), green, max wire 1.5mm2, RoHS; Supplier 1: https://www.chipdip.ru/product/dg127-5.08-02p-14-00a-h-klemmnik-degson-8007163023
X8 X9 = DG308-2.54-02P: Клеммник 2 конт. шаг 2.54 мм, вертик. на плату, H = 8.5 мм, провод под винт/микролифт (пров. 26-18AWG/ до 1.0 кв.мм), до 150В/6А, зеленый изол.; Supplier 1: https://www.chipdip.ru/product/dg308-2.54-02p-14-00ah-308-021-14-klemmnik-vintovoy-degson-63066?from=visited_product